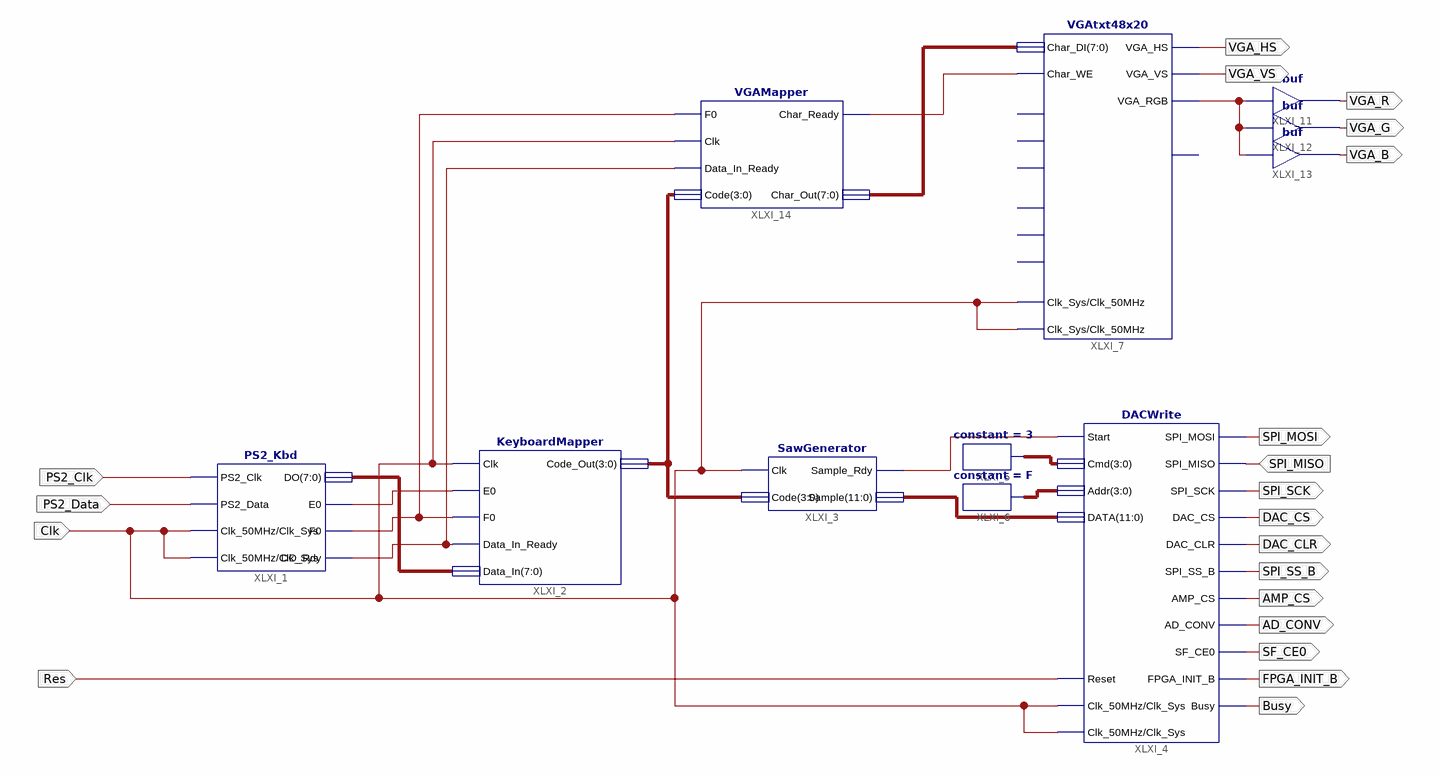
[diagram p0: schematic sheet 1]
// Xilinx ISE schematic schemaWithKeyboard.sch (spartan3e) as structural Verilog: 11 symbols, 20 ports
module schemaWithKeyboard (
  input  PS2_Clk,
  input  PS2_Data,
  input  Clk,
  input  SPI_MISO,
  input  Res,
  output SPI_MOSI,
  output SPI_SCK,
  output DAC_CS,
  output DAC_CLR,
  output SPI_SS_B,
  output AMP_CS,
  output AD_CONV,
  output SF_CE0,
  output FPGA_INIT_B,
  output Busy,
  output VGA_HS,
  output VGA_VS,
  output VGA_R,
  output VGA_G,
  output VGA_B
);

  wire XLXN_8, XLXN_11, XLXN_55, XLXN_62, XLXN_64, XLXN_66;
  wire [3:0] XLXN_26, XLXN_27, XLXN_67;
  wire [7:0] XLXN_30, XLXN_63;
  wire [11:0] XLXN_37;

  PS2_Kbd XLXI_1 (
    .PS2_Clk(PS2_Clk), .PS2_Data(PS2_Data), .Clk_50MHz(Clk), .E0(XLXN_8), .F0(XLXN_64), .DO_Rdy(XLXN_66),
    .DO(XLXN_30), .Clk_Sys(Clk));
  KeyboardMapper XLXI_2 (
    .Clk(Clk), .E0(XLXN_8), .F0(XLXN_64), .Data_In_Ready(XLXN_66), .Data_In(XLXN_30), .Code_Out(XLXN_67));
  SawGenerator XLXI_3 (.Clk(Clk), .Code(XLXN_67), .Sample_Rdy(XLXN_11), .Sample(XLXN_37));
  constant #(.CValue("3")) XLXI_5 (.O(XLXN_26));
  constant #(.CValue("F")) XLXI_6 (.O(XLXN_27));
  DACWrite XLXI_4 (
    .Reset(Res), .Start(XLXN_11), .SPI_MISO(SPI_MISO), .Cmd(XLXN_26), .Addr(XLXN_27), .DATA(XLXN_37),
    .DAC_CLR(DAC_CLR), .DAC_CS(DAC_CS), .SPI_MOSI(SPI_MOSI), .SPI_SCK(SPI_SCK), .SPI_SS_B(SPI_SS_B),
    .AMP_CS(AMP_CS), .AD_CONV(AD_CONV), .SF_CE0(SF_CE0), .FPGA_INIT_B(FPGA_INIT_B), .Busy(Busy),
    .Clk_50MHz(Clk), .Clk_Sys(Clk));
  VGAtxt48x20 XLXI_7 (
    .Char_DI(XLXN_63), .Clk_Sys(Clk), .Clk_50MHz(Clk), .VGA_HS(VGA_HS), .VGA_VS(VGA_VS), .VGA_RGB(XLXN_55),
    .Char_WE(XLXN_62));  // open: Home, NewLine, Goto00, CursorOn, ScrollEn, ScrollClear, Busy
  buf XLXI_11 (VGA_R, XLXN_55);
  buf XLXI_12 (VGA_G, XLXN_55);
  buf XLXI_13 (VGA_B, XLXN_55);
  VGAMapper XLXI_14 (
    .F0(XLXN_64), .Clk(Clk), .Data_In_Ready(XLXN_66), .Code(XLXN_67), .Char_Ready(XLXN_62), .Char_Out(XLXN_63));
endmodule
